# Altium schematic sheet DUAL_IO_TTL_BUFFER.SchDoc: Sayma AMC
size 420 x 297 mm; $$Internal___BlkDate: 0:12:25_2-9-18; $$Internal_NAME_PLACEHOLDER: a3sheet; $$Internal_Resolution: 00001mm; $$NotCommonProperty_@NAME: DUAL_IO_TTL_BUFFER; $$NotCommonProperty_@SHEET: 1; $$NotCommonProperty_@SHEETTOTAL: 30; CmpIndex: 26; Drawing Author: G.Kasprowicz; Drawing Number: Sayma AMC; Drawing Project: AMC FMC Carrier Board; Drawing Revision: 2.0; SymIndex: 2141; CheckedBy: P.Kulik,T.Przywozki,W.Ruclo; Author: G.Kasprowicz; CompanyName: WUT ISE; DrawnBy: G.Kasprowicz; Organization: WUT ISE; Address1: PW ISE; Address2: Nowowiejska 15/19 00-665 Warsaw; Address3: gkasprow@gmail.com; DocumentNumber: 19; Revision: 2; SheetNumber: 19; SheetTotal: 32; ModifiedBy: -; CheckedDate: -; Title2: Dual LVTTL buffer; DivGrp: WUT ISE; Designer: G.Kasprowicz; ModifiedDate: -; ProjectName: Sensor Box
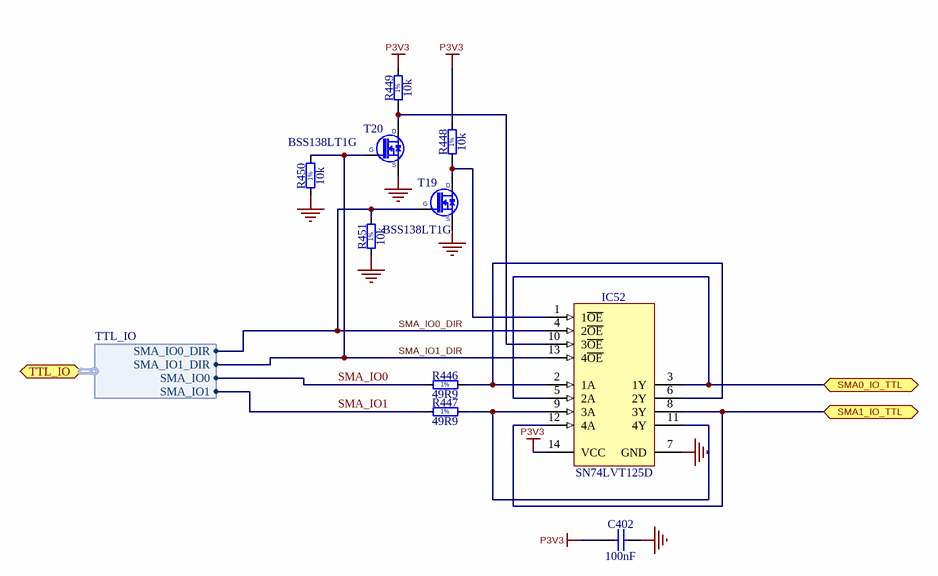
[diagram p0: DUAL_IO_TTL_BUFFER.SchDoc]

## Parts
C402  100nF  [CAPC0603X33N]
IC52  SN74LVT125D  [SOIC127P600X175-14N]
R446  49R9  [RESC1005X40N]
R447  49R9  [RESC1005X40N]
R448  10k  [RESC1005X40N]
R449  10k  [RESC1005X40N]
R450  10k  [RESC1005X40N]
R451  10k  [RESC1005X40N]
T19  BSS138LT1G  [SOT95P240X110-3N]
T20  BSS138LT1G  [SOT95P240X110-3N]

## Ports
SMA0_IO_TTL (bidir), SMA1_IO_TTL (bidir), TTL_IO (bidir, harness TTL_IO)

## Harnesses
TTL_IO: SMA_IO0, SMA_IO1, SMA_IO0_DIR, SMA_IO1_DIR

## Nets
GND: C402.2 IC52.7(GND) R450.1 R451.1 T19.2(S) T20.2(S)
P3V3: C402.1 IC52.14(VCC) R448.2 R449.2
SMA0_IO_TTL: IC52.3(1Y) IC52.5(2A) ; port SMA0_IO_TTL
SMA1_IO_TTL: IC52.8(3Y) IC52.12(4A) ; port SMA1_IO_TTL
SMA_IO0: R446.1 ; port TTL_IO.SMA_IO0
SMA_IO0_DIR: IC52.4(2~{OE}) R451.2 T19.1(G) ; port TTL_IO.SMA_IO0_DIR
SMA_IO1: R447.1 ; port TTL_IO.SMA_IO1
SMA_IO1_DIR: IC52.13(4~{OE}) R450.2 T20.1(G) ; port TTL_IO.SMA_IO1_DIR
NetIC52_1: IC52.1(1~{OE}) R448.1 T19.3(D)
NetIC52_2: IC52.2(1A) IC52.6(2Y) R446.2
NetIC52_9: IC52.9(3A) IC52.11(4Y) R447.2
NetIC52_10: IC52.10(3~{OE}) R449.1 T20.3(D)

## Notes on the sheet
- Project/Equipment
- Document
- Designer
- Drawn by
- Check.by
- Copyright WUT ISE 2018.
  This documentation describes Open Hardware and is licensed under the CERN OHL v.1.1. You may redistribute and modify this documentation under the terms of the CERN OHL v.1.1. (http://ohwr.org/CERNOHL). This documentation is distributed WITHOUT ANY EXPRESS OR IMPLIED WARRANTY, INCLUDING OF MERCHANTABILITY, SATISFACTORY QUALITY AND FITNESS FOR A PARTICULAR PURPOSE. Please see the CERN OHL v.1.1 for applicable conditions.
- Contact
- File
- Last Mod.
- Print Date
- Sheet
- Size
- A3
- of
- Rev
- (in symbol R0402_10K_1%_0.0625W_100PPM) 1%
- (in symbol R0402_49R9_1%_0.0625W_100PPM) 1%

## Library data of the parts
C402 = CC0201_100NF_6.3V_10%_X5R: Non-polarised capacitor; Manufacturer: GENERIC; Part Description: SMD Multilayer Chip Ceramic Capacitor; Manufacturer1 Part Number: 02016D104KAT2A; Tolerance: ±10%; Voltage: 6.3V; TC: X5R; Manufacturer Part Number: CC0201_100NF_6.3V_10%_X5R; Part Number: CC0201_100NF_6.3V_10%_X5R; Value: 100nF; Component Kind: Standard; Component Type: Standard; Pin Count: 2; Status: Not Recommended; Case: 0201; Mounted: Yes; Socket: No; SMD: Yes; Sense: No; Manufacturer1 Example: AVX; Manufacturer1 ComponentHeight: 0.33mm; HelpURL: \\cern.ch\dfs\Applications\Altium\Datasheets\CC0201_X5R_AVX.pdf; Author: CERN DEM JLC; CreateDate: 03.12.2007; LatestRevisionDate: 03.12.2007
IC52 = SN74LVT125D: Quadruple Bus Buffer with 3-State Outputs; Manufacturer: TEXAS INSTRUMENTS; Part Description: 3.3V ABT Quadruple Bus Buffer with 3-State Outputs; PressFit: No; Bonding: No; Manufacturer Part Number: SN74LVT125D; PackageDescription: SOIC 14, Pitch 1.27mm - Body 4x8.75mm, IPC Medium Density; Part Number: SN74LVT125D; Component Kind: Standard; Component Type: Standard; Device: SN74LVT125D; Pin Count: 14; Case: SOIC14; Mounted: Yes; Socket: No; SMD: Yes; Sense: No; ComponentHeight: 1.75mm; Author: CERN DEM JLC; HelpURL: \\cern.ch\dfs\Applications\Altium\Datasheets\SN74LVT125D.pdf; CreateDate: 01.06.2011; LatestRevisionDate: 01.06.2011
R446 R447 = R0402_49R9_1%_0.0625W_100PPM: Resistor - 1%; Manufacturer: GENERIC; Part Description: General Purpose Thick Film Chip Resistor; Manufacturer1 Part Number: 232270674999L or RC0402FR-0749R9L; TC: ±100ppm/°C; PressFit: No; Manufacturer Part Number: R0402_49R9_1%_0.0625W_100PPM; Part Number: R0402_49R9_1%_0.0625W_100PPM; Tolerance: ±1%; Value: 49R9; Component Kind: Standard; Component Type: Standard; Pin Count: 2; Status: Not Recommended; Power: 0.0625W; Case: 0402; Mounted: Yes; Sense: No; Socket: No; SMD: Yes; Manufacturer1 Example: YAGEO PHYCOMP; Manufacturer1 ComponentHeight: 0.4mm; HelpURL: \\cern.ch\dfs\Applications\Altium\Datasheets\R0402_Phycomp_RC0402.pdf; Author: CERN DEM JLC; CreateDate: 24.10.2012; LatestRevisionDate: 24.10.2012
R448-R451 = R0402_10K_1%_0.0625W_100PPM: Resistor - 1%; Manufacturer: GENERIC; Part Description: General Purpose Thick Film Chip Resistor; Manufacturer1 Part Number: 232270671003L; TC: ±100ppm/°C; PressFit: No; Manufacturer Part Number: R0402_10K_1%_0.0625W_100PPM; Part Number: R0402_10K_1%_0.0625W_100PPM; Tolerance: ±1%; Value: 10k; Component Kind: Standard; Component Type: Standard; Pin Count: 2; Status: Not Recommended; Power: 0.0625W; Case: 0402; Mounted: Yes; Sense: No; Socket: No; SMD: Yes; Manufacturer1 Example: YAGEO PHYCOMP; Manufacturer1 ComponentHeight: 0.4mm; HelpURL: \\cern.ch\dfs\Applications\Altium\Datasheets\R0402_Phycomp_RC0402.pdf; Author: CERN DEM JLC; CreateDate: 03.12.2007; LatestRevisionDate: 17.10.2012
T19 T20 = BSS138LT1G: N-CHANNEL MOSFET WITH DIODE; Manufacturer: ON SEMICONDUCTOR; Part Description: 50V 200mA N-Channel Enhancement Mode Field-Effect Transistor; PressFit: No; Bonding: No; Manufacturer Part Number: BSS138LT1G; PackageDescription: SOT23 3-Leads, Pitch 0.95mm - Body 1.4x3mm, IPC Medium Density; Part Number: BSS138LT1G; Component Kind: Standard; Component Type: Standard; Device: BSS138LT1G; Pin Count: 3; Case: SOT23-3; Mounted: Yes; Socket: No; SMD: Yes; Sense: No; ComponentHeight: 1.11mm; HelpURL: \\cern.ch\dfs\Applications\Altium\Datasheets\BSS138LT1G.pdf; Author: CERN DEM JLC; CreateDate: 23.03.2009; LatestRevisionDate: 23.03.2009